# Altium schematic sheet DAC_Board.SchDoc: DAC
size A4; Author: Jeremy Metzner; CompanyName: University of Oregon; Organization: University of Oregon; Address1: Oregon Ions; Address2: Eugene; Address3: OR; DocumentNumber: 1; Revision: V1.1; SheetNumber: 1; SheetTotal: 1
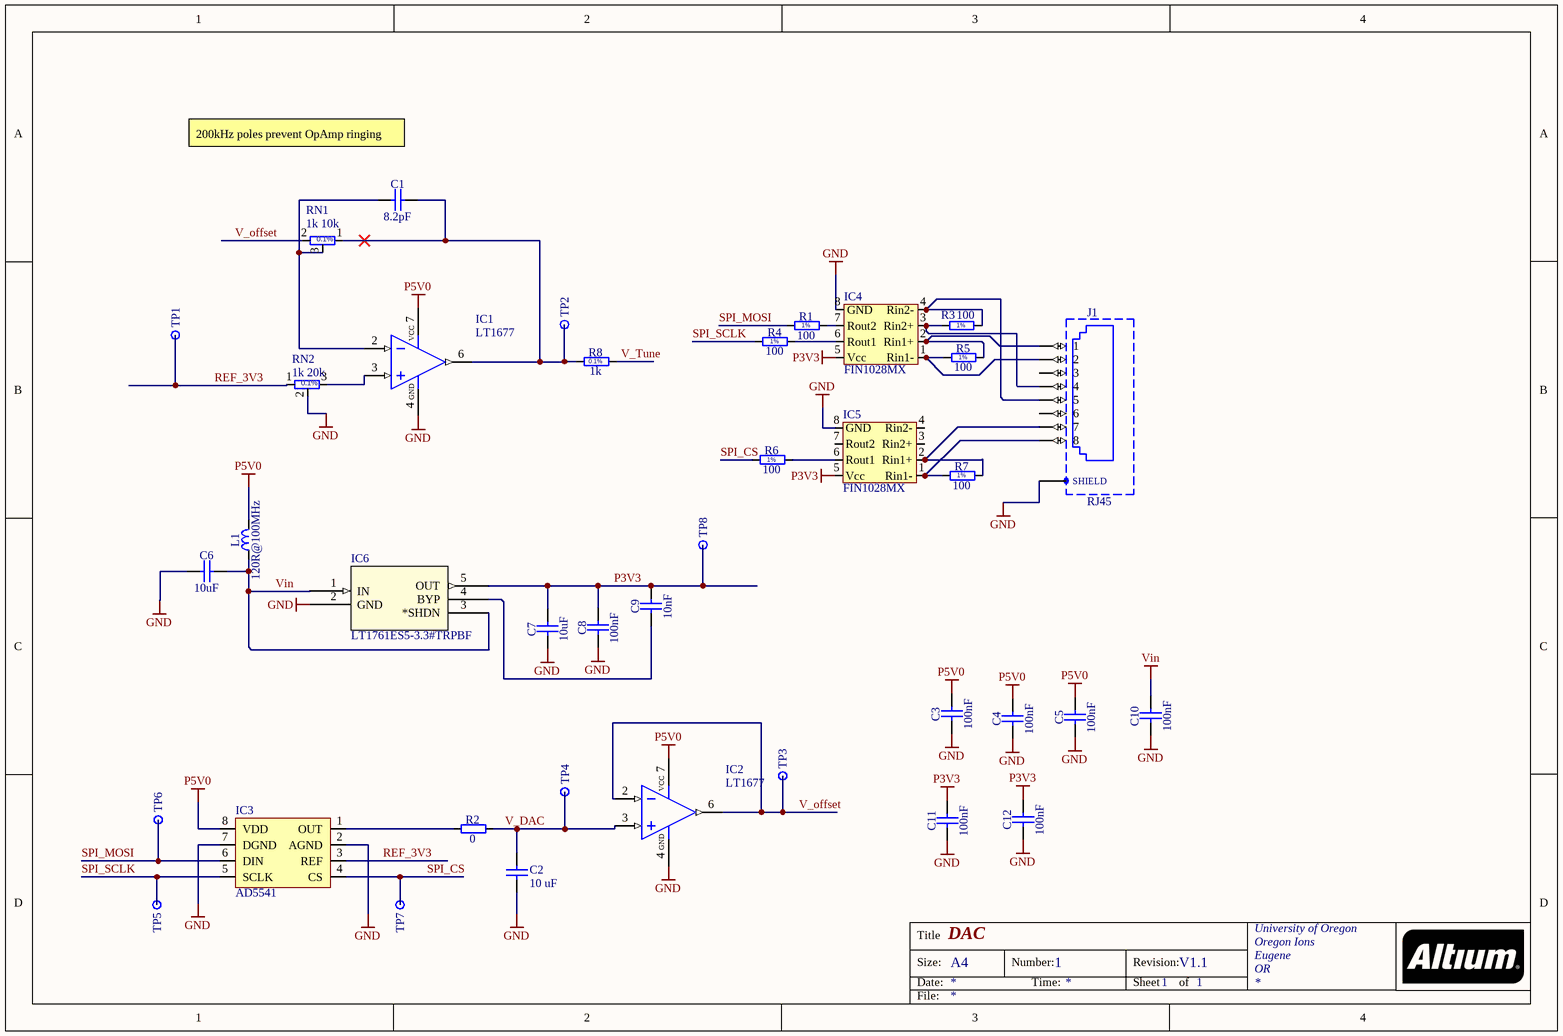
[diagram p0: DAC_Board.SchDoc]

## Parts
C1  8.2pF  [CAPC1608X87N]
C2  10 uF  [CAPC5750X279N]
C3  100nF  [CAPC1608X87N]
C4  100nF  [CAPC1608X87N]
C5  100nF  [CAPC1608X87N]
C6  10uF  [CAPC3216X180N]
C7  10uF  [CAPC3216X180N]
C8  100nF  [CAPC1608X87N]
C9  10nF  [CAPC1608X87N]
C10  100nF  [CAPC1608X87N]
C11  100nF  [CAPC1608X87N]
C12  100nF  [CAPC1608X87N]
IC1  LT1677  [SOIC127P600X175-8N]
IC2  LT1677  [SOIC127P600X175-8N]
IC3  AD5541  [AD5541]
IC4  FIN1028MX  [FIN1028MX]
IC5  FIN1028MX  [FIN1028MX]
IC6  LT1761ES5-3.3#TRPBF  [LDO]
J1  RJ45  [TYCO_6368150-1]
L1  120R@100MHz  [INDC1608X95N]
R1  100  [RESC1608X55N]
R2  0  [RESC1608X55N]
R3  100  [RESC1608X55N]
R4  100  [RESC1608X55N]
R5  100  [RESC1608X55N]
R6  100  [RESC1608X55N]
R7  100  [RESC1608X55N]
R8  1k  [RESC1608X55N]
RN1  (no value)  [SOT95P230X112-3N]
RN2  (no value)  [SOT95P230X112-3N]
TP1  Test Point  [TPS127]  (value not drawn)
TP2  Test Point  [TPS127]  (value not drawn)
TP3  Test Point  [TPS127]  (value not drawn)
TP4  Test Point  [TPS127]  (value not drawn)
TP5  Test Point  [TPS127]  (value not drawn)
TP6  Test Point  [TPS127]  (value not drawn)
TP7  Test Point  [TPS127]  (value not drawn)
TP8  Test Point  [TPS127]  (value not drawn)

## Nets
GND: C2.1 C3.1 C4.1 C5.1 C6.1 C7.1 C8.1 C10.1 C11.1 C12.1 IC1.4(GND) IC2.4(GND) IC3.2(AGND) IC3.7(DGND) IC4.8(GND) IC5.8(GND) IC6.2(GND) J1.SHIELD RN2.2
P3V3: C7.2 C8.2 C9.2 C11.2 C12.2 IC4.5(Vcc) IC5.5(Vcc) IC6.5(OUT) TP8.1
P5V0: C3.2 C4.2 C5.2 IC1.7(Vs+) IC2.7(Vs+) IC3.8(VDD) L1.2
Vin: C6.2 C10.2 IC6.1(IN) IC6.3(*SHDN) L1.1
REF_3V3: IC3.3(REF) RN2.1 TP1.1
SPI_CS: IC3.4(CS) R6.1 TP7.1
SPI_MOSI: IC3.6(DIN) R1.1 TP6.1
SPI_SCLK: IC3.5(SCLK) R4.1 TP5.1
V_DAC: C2.2 IC2.3(IN+) R2.2 TP4.1
V_offset: IC2.2(IN-) IC2.6(OUT) RN1.2 TP3.1
V_Tune: R8.2
NetC1_1: C1.1 IC1.2(IN-) RN1.3
NetC1_2: C1.2 IC1.6(OUT) R8.1 RN1.1 TP2.1
NetC9_1: C9.1 IC6.4(BYP)
NetIC1_3: IC1.3(IN+) RN2.3
NetIC3_1: IC3.1(OUT) R2.1
NetIC4_1: IC4.1(Rin1-) J1.2 R5.1
NetIC4_2: IC4.2(Rin1+) J1.1 R5.2
NetIC4_3: IC4.3(Rin2+) J1.4 R3.1
NetIC4_4: IC4.4(Rin2-) J1.5 R3.2
NetIC4_6: IC4.6(Rout1) R4.2
NetIC4_7: IC4.7(Rout2) R1.2
NetIC5_1: IC5.1(Rin1-) J1.8 R7.1
NetIC5_2: IC5.2(Rin1+) J1.7 R7.2
NetIC5_6: IC5.6(Rout1) R6.2

Not connected (* = marked no-connect by the designer): IC5 3(Rin2+) 4(Rin2-) 7(Rout2); J1 3 6

## Notes on the sheet
- 200kHz poles prevent OpAmp ringing
- Title
- Size:
- Date:
- A4
- Number:
- Time:
- Revision:
- Sheet
- of
- File:
- (in symbol LT1677) VCC
- (in symbol R0603_1K0_0.1%_0.063W_10PPM) 0.1%
- (in symbol R0603_100R_1%_0.1W_100PPM) 1%
- (in symbol RN_1k_10k_VISHAY_MPMT10011002AT1) 1k 10k; 0.1%
- (in symbol RN_1k_20k_VISHAY_MPMT10012002AT1) 1k 20k; 0.1%

## Library data of the parts
C1 = CC0603_8.2PF_50V_0.5PF_NP0: Non-polarised capacitor; Part Description: SMD Multilayer Chip Ceramic Capacitor; Manufacturer: GENERIC; Manufacturer1 Part Number: 223886715828; Voltage: 50V; TC: C0G/NP0; Tolerance: ±0.5pF; Part Number: CC0603_8.2PF_50V_0.5PF_NP0; Component Kind: Standard; Component Type: Standard; Pin Count: 2; Value: 8.2pF; Status: Preferred; Manufacturer Part Number: CC0603_8.2PF_50V_0.5PF_NP0; Case: 0603; Mounted: Yes; Socket: No; SMD: Yes; Sense: No; Manufacturer1 Example: PHYCOMP; Manufacturer1 ComponentHeight: 0.87mm; HelpURL: \\cern.ch\dfs\Applications\Altium\Datasheets\CC0603_NP0_PHYCOMP.pdf; Author: CERN DEM JLC; CreateDate: 03/12/2007; LatestRevisionDate: 03/12/2007
C2 = CAPF2220_10uF_25V_20%
C3-C5 C8 C10-C12 = CC0603_100NF_50V_10%_X7R: Non-polarised capacitor; Part Description: SMD Multilayer Chip Ceramic Capacitor; Manufacturer: GENERIC; Manufacturer1 Part Number: 223858615649; Voltage: 50V; TC: X7R; Tolerance: ±10%; Part Number: CC0603_100NF_50V_10%_X7R; Component Kind: Standard; Component Type: Standard; Pin Count: 2; Value: 100nF; Status: Preferred; Manufacturer Part Number: CC0603_100NF_50V_10%_X7R; Case: 0603; Mounted: Yes; Socket: No; SMD: Yes; Sense: No; Manufacturer1 Example: PHYCOMP; Manufacturer1 ComponentHeight: 0.87mm; HelpURL: \\cern.ch\dfs\Applications\Altium\Datasheets\CC0603_X7R_PHYCOMP.pdf; Author: CERN DEM JLC; CreateDate: 12/3/2007; LatestRevisionDate: 12/3/2007
C6 C7 = CC1206_10UF_25V_10%_X7R: Non-polarised capacitor; Part Description: SMD Multilayer Chip Ceramic Capacitor; Manufacturer: GENERIC; Manufacturer1 Part Number: C1206C106K4RACTU; Voltage: 25V; TC: X7R; Tolerance: ±10%; Part Number: CC1206_10UF_25V_10%_X7R; Component Kind: Standard; Component Type: Standard; Pin Count: 2; Value: 10uF; Status: Preferred; Manufacturer Part Number: CC1206_10uF_25V_10%_X7R; Case: 1206; Mounted: Yes; Socket: No; SMD: Yes; Sense: No; Manufacturer1 Example: KEMET; Manufacturer1 ComponentHeight: 1.8mm; HelpURL: \\cern.ch\dfs\Applications\Altium\Datasheets\CC1206_X7R_KEMET.pdf; Author: CERN DEM JLC; CreateDate: 12/09/2012; LatestRevisionDate: 12/09/2012
C9 = CC0603_10NF_50V_10%_X7R: Non-polarised capacitor; Part Description: SMD Multilayer Chip Ceramic Capacitor; Manufacturer: GENERIC; Manufacturer1 Part Number: 223858615636; Voltage: 50V; TC: X7R; Tolerance: ±10%; Part Number: CC0603_10NF_50V_10%_X7R; Component Kind: Standard; Component Type: Standard; Pin Count: 2; Value: 10nF; Status: Preferred; Manufacturer Part Number: CC0603_10NF_50V_10%_X7R; Case: 0603; Mounted: Yes; Socket: No; SMD: Yes; Sense: No; Manufacturer1 Example: PHYCOMP; Manufacturer1 ComponentHeight: 0.87mm; HelpURL: \\cern.ch\dfs\Applications\Altium\Datasheets\CC0603_X7R_PHYCOMP.pdf; Author: CERN DEM JLC; CreateDate: 12/3/2007; LatestRevisionDate: 12/3/2007
IC1 IC2 = LT1677: 0-5 V Rail to Rail op amp
IC3 = AD5541: 16 bit serial DAC; Supplier 1: Digi-Key
IC4 IC5 = FIN1028MX: LVDS to TTL
IC6 = LT1761ES5-3.3#TRPBF: 3.3 V LDO
J1 = TYCO_6368150-1: Connector RJ45 + Shield; Part Description: RJ45 Connector, 1 Port, 8 Positions, Shielded, Straight, Category 5; Manufacturer: TYCO ELECTRONICS; PressFit: No; Part Number: TYCO_6368150-1; Component Kind: Standard; Component Type: Standard; Pin Count: 10; Family: RJ45; Mounted: Yes; Socket: No; SMD: No; Sense: No; Status: None; Manufacturer Part Number: 6368150-1; ComponentHeight: 17.02mm; HelpURL: \\cern.ch\dfs\Applications\Altium\Datasheets\TYCO_6368150-1.pdf; Author: CERN DEM MR; CreateDate: 6/18/2019; LatestRevisionDate: 6/18/2019
L1 = IND0603_MURATA_BLM18PG121SN1D: Inductor; Part Description: SMD EMIFIL Chip Ferrite Bead; Manufacturer: MURATA; Power: 2A; Resistance: 0.05R; Part Number: IND0603_MURATA_BLM18PG121SN1D; Component Kind: Standard; Component Type: Standard; Pin Count: 2; Value: 120R@100MHz; Status: None; Manufacturer Part Number: BLM18PG121SN1D; Case: 0603; Mounted: Yes; Socket: No; SMD: Yes; Sense: No; ComponentHeight: 0.95mm; HelpURL: \\cern.ch\dfs\Applications\Altium\Datasheets\IND0603_MURATA_BLM18P.pdf; Author: CERN DEM BC; CreateDate: 27/07/2015; LatestRevisionDate: 27/07/2015
R1 R3-R7 = R0603_100R_1%_0.1W_100PPM: Resistor - 1%; Part Description: General Purpose Thick Film Chip Resistor; Manufacturer: GENERIC; Manufacturer1 Part Number: NRC06F4700TRF; Power: 0.1W; TC: ±100ppm/°C; PressFit: No; Part Number: R0603_100R_1%_0.1W_100PPM; Component Kind: Standard; Component Type: Standard; Pin Count: 2; Value: 100; Status: Preferred; Tolerance: ±1%; Manufacturer Part Number: R0603_100R_1%_0.1W_100PPM; Case: 0603; Mounted: Yes; Sense: No; Socket: No; SMD: Yes; Manufacturer1 Example: NIC COMPONENT; Manufacturer1 ComponentHeight: 0.55mm; HelpURL: \\cern.ch\dfs\Applications\Altium\Datasheets\R0603_NIC_NRC.pdf; Author: CERN DEM JLC; CreateDate: 12/3/2007; LatestRevisionDate: 3/13/2008
R2 = R0603_0R_JUMPER: Resistor; Part Description: 1A (0.05R Max DC Resistance) Zero Ohm Jumper; Manufacturer: GENERIC; Manufacturer1 Part Number: NRC06Z0; PressFit: No; Part Number: R0603_0R_JUMPER; Component Kind: Standard; Component Type: Standard; Pin Count: 2; Value: 0; Status: Preferred; Manufacturer Part Number: R0603_0R_JUMPER; Case: 0603; Mounted: Yes; Sense: No; Socket: No; SMD: Yes; Manufacturer1 Example: NIC COMPONENT; Manufacturer1 ComponentHeight: 0.55mm; HelpURL: \\cern.ch\dfs\Applications\Altium\Datasheets\R0603_NIC_NRC.pdf; Author: CERN DEM JLC; CreateDate: 12/3/2007; LatestRevisionDate: 3/13/2008
R8 = R0603_1K0_0.1%_0.063W_10PPM: Resistor - 0.1%; Part Description: Thin Film Chip Resistor; Manufacturer: GENERIC; Manufacturer1 Part Number: RN73C1J1K0BTDF; Power: 0.063W; TC: ±10ppm; PressFit: No; Part Number: R0603_1K0_0.1%_0.063W_10PPM; Component Kind: Standard; Component Type: Standard; Pin Count: 2; Value: 1k; Status: Not Recommended; Tolerance: ±0.1%; Manufacturer Part Number: R0603_1K0_0.1%_0.063W_10PPM; Case: 0603; Mounted: Yes; Sense: No; Socket: No; SMD: Yes; Manufacturer1 Example: TYCO HOLSWORTHY; Manufacturer1 ComponentHeight: 0.5mm; HelpURL: \\cern.ch\dfs\Applications\Altium\Datasheets\R0603_Tyco_RN73.pdf; Author: CERN DEM JLC; CreateDate: 12/3/2007; LatestRevisionDate: 3/13/2008
RN1 = RN_1k_10k_VISHAY_MPMT10011002AT1: Resistor Network Divider - 0.1%
RN2 = RN_1k_20k_VISHAY_MPMT10012002AT1: Resistor Network Divider - 0.1%
TP1-TP8 = SMD_PAD_1.27X1.27MM: Part Description: 1.27mm x 1.27mm PCB Copper Area (SMD Test Point); Mounted: No; Part Number: SMD_PAD_1.27X1.27MM; Component Kind: Standard (No BOM); Component Type: Standard (No BOM); Pin Count: 1; Family: Test Point; Socket: No; Sense: No; Status: None; ComponentHeight: 0mm; HelpURL: Undefined; Author: CERN DEM JLC; PackageDescription: 1.27mm x 1.27mm PCB Copper Area (SMD Test Point)
  TP1 TP2: SMD: Yes; CreateDate: 12/01/2008; LatestRevisionDate: 12/01/2008
  TP3-TP8: SMD: No; CreateDate: 1/12/2008; LatestRevisionDate: 1/12/2008